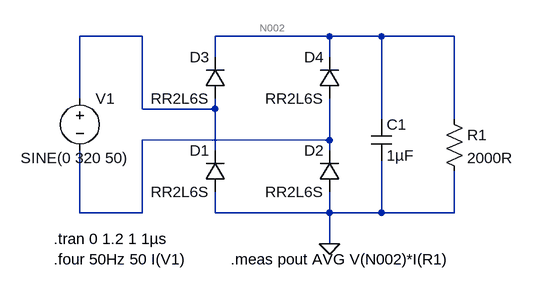
[diagram p0: schematic Part 7 - Power Factor and Harmonic content - Class D limit.asc]
Part 7 - Power Factor and Harmonic content - Class D limit.asc, the LTspice schematic file:
Version 4
SHEET 1 1000 680
WIRE -48 -32 -144 -32
WIRE 240 -32 64 -32
WIRE 320 -32 240 -32
WIRE 432 -32 320 -32
WIRE 64 0 64 -32
WIRE 240 0 240 -32
WIRE -144 64 -144 -32
WIRE -48 80 -48 -32
WIRE 64 80 64 64
WIRE 64 80 -48 80
WIRE 320 96 320 -32
WIRE 432 96 432 -32
WIRE 240 128 240 64
WIRE 240 128 -48 128
WIRE 64 144 64 80
WIRE 240 144 240 128
WIRE -144 240 -144 144
WIRE -48 240 -48 128
WIRE -48 240 -144 240
WIRE 64 240 64 208
WIRE 240 240 240 208
WIRE 240 240 64 240
WIRE 320 240 320 160
WIRE 320 240 240 240
WIRE 432 240 432 176
WIRE 432 240 320 240
WIRE 240 288 240 240
FLAG 240 288 0
SYMBOL diode 80 208 R180
WINDOW 0 24 64 Left 2
WINDOW 3 24 0 Left 2
SYMATTR InstName D1
SYMATTR Value RR2L6S
SYMBOL diode 256 208 R180
WINDOW 0 24 64 Left 2
WINDOW 3 24 0 Left 2
SYMATTR InstName D2
SYMATTR Value RR2L6S
SYMBOL diode 80 64 R180
WINDOW 0 24 64 Left 2
WINDOW 3 24 0 Left 2
SYMATTR InstName D3
SYMATTR Value RR2L6S
SYMBOL diode 256 64 R180
WINDOW 0 24 64 Left 2
WINDOW 3 24 0 Left 2
SYMATTR InstName D4
SYMATTR Value RR2L6S
SYMBOL voltage -144 48 R0
WINDOW 123 0 0 Left 0
WINDOW 39 0 0 Left 0
WINDOW 3 -91 108 Left 2
SYMATTR Value SINE(0 320 50)
SYMATTR InstName V1
SYMBOL res 416 80 R0
SYMATTR InstName R1
SYMATTR Value 2000R
SYMBOL cap 304 96 R0
SYMATTR InstName C1
SYMATTR Value 1µF
TEXT -184 280 Left 2 !.tran 0 1.2 1 1µs
TEXT -184 312 Left 2 !.four 50Hz 50 I(V1)
TEXT 88 312 Left 2 !.meas pout AVG V(N002)*I(R1)

The netlist it stands for:
* Part 7 - Power Factor and Harmonic content - Class D limit.asc
D1 0 N001 RR2L6S
D2 0 N003 RR2L6S
D3 N001 N002 RR2L6S
D4 N003 N002 RR2L6S
V1 N001 N003 SINE(0 320 50)
R1 N002 0 2000R
C1 N002 0 1µF
.model D D
.lib standard.dio
.tran 0 1.2 1 1µs
.four 50Hz 50 I(V1)
.meas pout AVG V(N002)*I(R1)
.backanno
.end